# EAGLE design respirho675 (EAGLE 9.6.2)
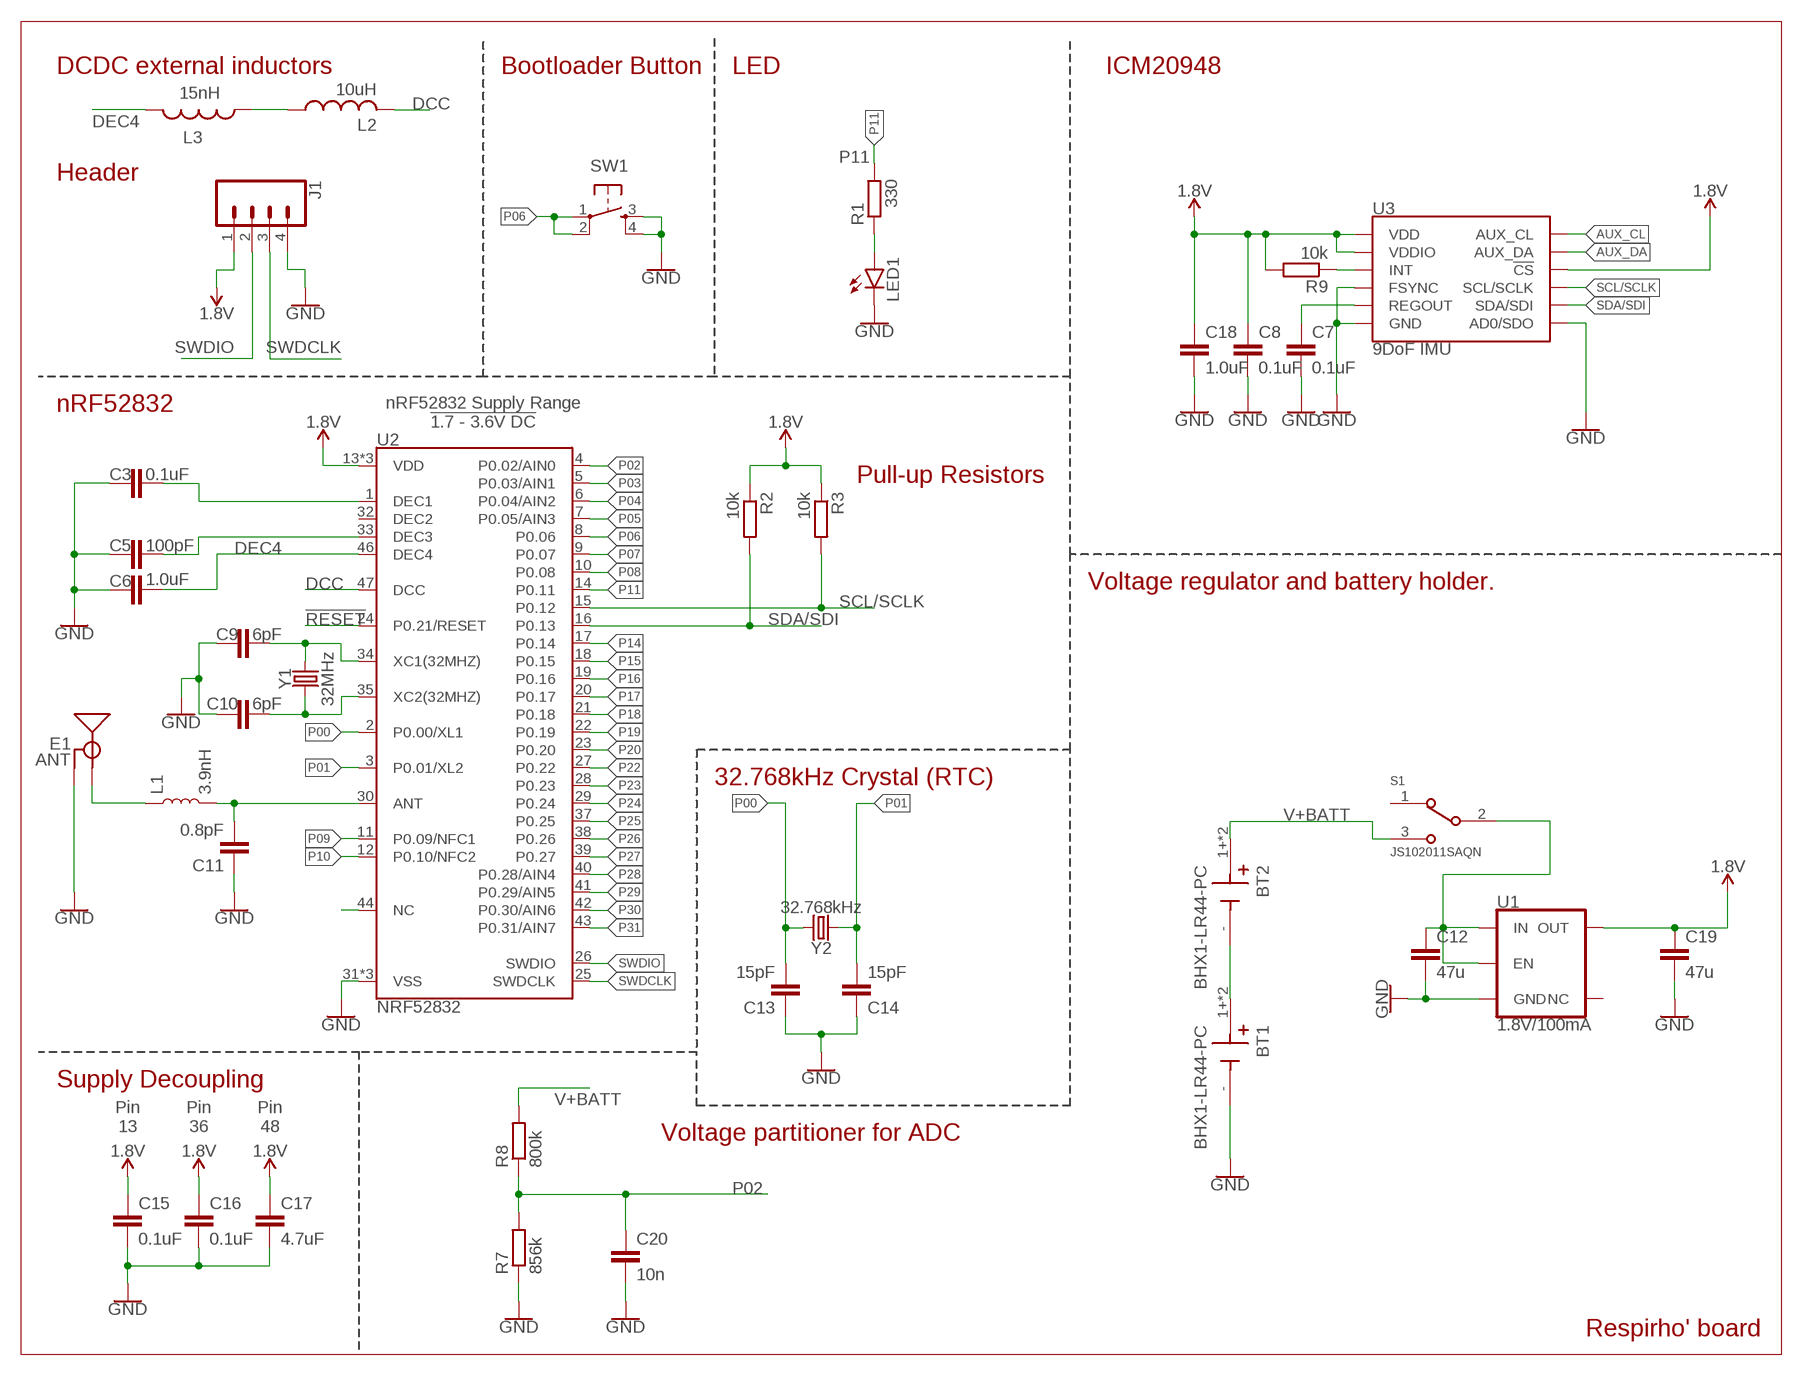
[diagram p0: schematic, sheet 1]

## Parts
BT1  BHX1-LR44-PC  [BAT_BHX1-LR44-PC]
BT2  BHX1-LR44-PC  [BAT_BHX1-LR44-PC]
C3  0.1uF  0.1UF-0402-16V-10%  [0402]
C5  100pF  100PF-0402-50V-5%  [0402]
C6  1.0uF  1.0UF-0402-16V-10%  [0402]
C7  0.1uF  0.1UF-0603-25V-5%  [0603]
C8  0.1uF  0.1UF-0603-25V-5%  [0603]
C9  6pF  6PF-0402-50V-0.5%  [0402]
C10  6pF  6PF-0402-50V-0.5%  [0402]
C11  0.8pF  0.8PF-0402-50V-0.1PF  [0402]
C12  47u  C-EUC0603  [C0603]
C13  15pF  15PF-0402-50V-5%  [0402]
C14  15pF  15PF-0402-50V-5%  [0402]
C15  0.1uF  0.1UF-0402-16V-10%  [0402]
C16  0.1uF  0.1UF-0402-16V-10%  [0402]
C17  4.7uF  4.7UF0603  [0603]
C18  1.0uF  1.0UF-0603-16V-10%-X7R  [0603]
C19  47u  C-EUC0603  [C0603]
C20  10n  C-EUC0603  [C0603]
E1  ANT  ANTENNA-GROUNDEDTRACE-15.2MM  [TRACE_ANTENNA_2.4GHZ_15.2MM]
J1  CONN_04PTH  [1X04]
L1  3.9nH  INDUCTOR-0402-3.9NH  [0402]
L2  10uH  INDUCTOR_0603_L  [RESC0603_L]
L3  15nH  LQG15HS15NJ02D  [INDC1005X55N]
LED1  LEDCHIPLED_1206  [CHIPLED_1206]
R1  330  R-EU_R0805  [R0805]
R2  10k  R-EU_R0603  [R0603]
R3  10k  R-EU_R0603  [R0603]
R7  856k  R-EU_R0603  [R0603]
R8  800k  R-EU_R0603  [R0603]
R9  10k  R-EU_R0603  [R0603]
S1  JS102011SAQN  [SW_JS102011SAQN]
SW1  SWITCH_SPST_4_PINRECT  [TACTILE_SWITCH_SMD_4.6X2.8MM]
U1  1.8V/100mA  V_REG_SP6214-1.8V  [SC70]
U2  NRF52832  [QFN48-6X6MM]
U3  9DoF IMU  ICM-20948  [QFN24-3X3]
Y1  32MHz  CRYSTAL-32MHZ-SMD-2.0X1.6MM  [CRYSTAL-SMD-2.0X1.6MM]
Y2  32.768kHz  CRYSTAL-32.768KHZSMD-3.2X1.5  [CRYSTAL-SMD-3.2X1.5MM]

## Nets
1.8V: C8.1 C15.1 C16.1 C17.1 C18.1 C19.1 J1.1 R2.1 R3.1 R9.2 U1.5(OUT) U2.13(VDD) U2.36(VDD) U2.48(VDD) U3.8(VDDIO) U3.13(VDD) U3.22(!CS)
!RESET!: U2.24(P0.21/RESET)
ANT: C11.2 L1.2 U2.30(ANT)
AUX_CL: U3.7(AUX_CL)
AUX_DA: U3.21(AUX_DA)
DCC: L2.2 U2.47(DCC)
DEC1: C3.2 U2.1(DEC1)
DEC3: C5.2 U2.33(DEC3)
DEC4: C6.2 L3.2 U2.46(DEC4)
GND: BT1.- C3.1 C5.1 C6.1 C7.2 C8.2 C9.1 C10.2 C11.1 C12.2 C13.1 C14.1 C15.2 C16.2 C17.2 C18.2 C19.2 C20.2 E1.GND J1.4 LED1.C R7.1 SW1.3 SW1.4 U1.2(GND) U2.31(VSS) U2.45(VSS) U2.EP(VSS) U3.9(AD0/SDO) U3.11(FSYNC) U3.18(GND) U3.20(GND)
N$1: LED1.A R1.1
N$2: C7.1 U3.10(REGOUT)
N$3: R9.1 U3.12(INT)
N$5: L2.1 L3.1
N$6: BT1.1+(+) BT1.2+(+) BT2.-
N$7: C12.1 S1.2 U1.1(IN) U1.3(EN)
N$11: E1.ANT(SIGNAL) L1.1
NC: U2.44(NC)
P00: C13.2 U2.2(P0.00/XL1) Y2.P$2
P01: C14.2 U2.3(P0.01/XL2) Y2.P$1
P02: C20.1 R7.2 R8.1 U2.4(P0.02/AIN0)
P03: U2.5(P0.03/AIN1)
P04: U2.6(P0.04/AIN2)
P05: U2.7(P0.05/AIN3)
P06: SW1.1 SW1.2 U2.8(P0.06)
P07: U2.9(P0.07)
P08: U2.10(P0.08)
P09: U2.11(P0.09/NFC1)
P10: U2.12(P0.10/NFC2)
P11: R1.2 U2.14(P0.11)
P14: U2.17(P0.14)
P15: U2.18(P0.15)
P16: U2.19(P0.16)
P17: U2.20(P0.17)
P18: U2.21(P0.18)
P19: U2.22(P0.19)
P20: U2.23(P0.20)
P22: U2.27(P0.22)
P23: U2.28(P0.23)
P24: U2.29(P0.24)
P25: U2.37(P0.25)
P26: U2.38(P0.26)
P27: U2.39(P0.27)
P28: U2.40(P0.28/AIN4)
P29: U2.41(P0.29/AIN5)
P30: U2.42(P0.30/AIN6)
P31: U2.43(P0.31/AIN7)
SCL/SCLK: R3.2 U2.15(P0.12) U3.23(SCL/SCLK)
SDA/SDI: R2.2 U2.16(P0.13) U3.24(SDA/SDI)
SWDCLK: J1.3 U2.25(SWDCLK)
SWDIO: J1.2 U2.26(SWDIO)
V+BATT: BT2.1+(+) BT2.2+(+) R8.2 S1.3
XC1: C9.2 U2.34(XC1(32MHZ)) Y1.3
XC2: C10.1 U2.35(XC2(32MHZ)) Y1.1
Unconnected: S1.1 U1.4(NC) U2.32(DEC2)

## Notes on the sheet
- DCDC external inductors | Bootloader Button | LED | ICM20948
- Header
- nRF52832
- nRF52832 Supply Range
  !1.7 - 3.6V DC!
- Pull-up Resistors
- Voltage regulator and battery holder.
- 32.768kHz Crystal (RTC)
- Supply Decoupling
- Pin
  13
- Pin
  36
- Pin
  48
- Voltage partitioner for ADC
- Respirho' board

## Library data of the parts
BT1 BT2 = BHX1-LR44-PC:BHX1-LR44-PC: Battery Retainer Coin, 12.0mm 1 Cell PC Pin; DESCRIPTION: Battery Retainer Coin, 12.0mm 1 Cell PC Pin; DIGI-KEY_PART_NUMBER: BHX1-LR44-PC-G-ND; MF: MPD; MP: BHX1-LR44-PC; PACKAGE: None; PURCHASE-URL: https://pricing.snapeda.com/search/part/BHX1-LR44-PC/?ref=eda
C3 C15 C16 = SparkFun-Capacitors:0.1UF: 0.1µF ceramic capacitors A capacitor is a passive two-terminal electrical component used to store electrical energy temporarily in an electric field.; PROD_ID: CAP-12416
C5 = nrf52832-breakout-temp:100PF: 100pF/0.1nF ceramic capacitors A capacitor is a passive two-terminal electrical component used to store electrical energy temporarily in an electric field.; PROD_ID: CAP-13458
C6 = SparkFun-Capacitors:1.0UF: 1µF ceramic capacitors A capacitor is a passive two-terminal electrical component used to store electrical energy temporarily in an electric field.; PROD_ID: CAP-12417
C7 C8 = SparkFun-Capacitors:0.1UF: 0.1µF ceramic capacitors A capacitor is a passive two-terminal electrical component used to store electrical energy temporarily in an electric field.; PROD_ID: CAP-08604
C9 C10 = nrf52832-breakout-temp:6PF: 15pF ceramic capacitors A capacitor is a passive two-terminal electrical component used to store electrical energy temporarily in an electric field.; PROD_ID: CAP-13455
C11 = nrf52832-breakout-temp:0.8PF: 0.8pF ceramic capacitors A capacitor is a passive two-terminal electrical component used to store electrical energy temporarily in an electric field.; PROD_ID: CAP-13456
C12 C19 C20 = rcl:C-EU: CAPACITOR, European symbol; SPICEPREFIX: C
C13 C14 = SparkFun-Capacitors:15PF: 15pF ceramic capacitors A capacitor is a passive two-terminal electrical component used to store electrical energy temporarily in an electric field.; PROD_ID: CAP-13063
C17 = SparkFun-Capacitors:4.7UF: 4.7µF ceramic capacitors A capacitor is a passive two-terminal electrical component used to store electrical energy temporarily in an electric field.; PROD_ID: CAP-08280
C18 = SparkFun-Capacitors:1.0UF: 1µF ceramic capacitors A capacitor is a passive two-terminal electrical component used to store electrical energy temporarily in an electric field.; PROD_ID: CAP-13930
E1 = SparkFun-RF:ANTENNA-GROUNDED: Antenna w/ Ground Connection 2.4GHz antennae with signal and ground terminals. TRACE_ANTENNA_2.4GHZ_15.2MM - Meander Trace antenna 15.2 x 5.7mm footprint Based on layout from TI app note AN043 <http://www.ti.com/lit/an/swra117d/swra117d.pdf>. TRACE_ANTENNA_2.4GHZ_25.7MM - Inverted F trace antenna 25.7 x 7.5 mm footprint. Based on layout from TI design note DN0007 <http://www.ti.com/lit/an/swru120b/swru120b.pdf>.
J1 = SparkFun-Connectors:CONN_04: Multi connection point. Often used as Generic Header-pin footprint for 0.1 inch spaced/style header connections On any of the 0.1 inch spaced packages, you can populate with these: Break Away Headers - Straight <https://www.sparkfun.com/products/116> (PRT-00116) Break Away Male Headers - Right Angle <https://www.sparkfun.com/products/553> (PRT-00553) Female Headers <https://www.sparkfun.com/products/115> (PRT-00115) Break Away Headers - Machine Pin <https://www.sparkfun.com/products/117> (PRT-00117) Break Away Female Headers - Swiss Machine Pin <https://www.sparkfun.com/products/743> (PRT-00743) For SCREWTERMINALS and SPRING TERMINALS visit here: Screw Terimnals on SparkFun.com <https://www.sparkfun.com/search/results?term=Screw+Terminals> (5mm/3.5mm/2.54mm spacing) This device is also useful as a general connection point to wire up your design to another part of your project. Our various solder wires solder well into these plated through hole pads. Hook-Up Wire - Assortment (Stranded, 22 AWG) <https://www.sparkfun.com/products/11375> (PRT-11375) Hook-Up Wire - Assortment (Solid Core, 22 AWG) <https://www.sparkfun.com/products/11367> (PRT-11367) View the entire wire category on our website here <https://www.sparkfun.com/categories/141> Special notes: Molex polarized connector foot print use with SKU : PRT-08231 with associated crimp pins and housings. 1MM SMD Version SKU: PRT-10208; PROD_ID: CONN-09696
L1 = nrf52832-breakout-temp:INDUCTOR: Inductors Resist changes in electrical current. Basically a coil of wire. SparkFun Products: SparkFun Load Cell Amplifier - HX711 <https://www.sparkfun.com/products/13879> IOIO-OTG - V2.2 <https://www.sparkfun.com/products/13613>; PROD_ID: NDUC-13457
L2 = Nordic_nRF:INDUCTOR: Generic chip inductor
L3 = LQG15HS15NJ02D:LQG15HS15NJ02D: Ind RF Chip Multi-Layer 15nH 5% 100MHz 8Q-Factor Air 300mA 0402 Paper T/R; DESCRIPTION: Inductor with Inductance: 15nH Tol. +/-5%, Package: 0402 _1005_; DIGI-KEY_PART_NUMBER: 490-2625-1-ND; DIGI-KEY_PURCHASE_URL: https://www.digikey.com/product-detail/en/murata-electronics/LQG15HS15NJ02D/490-2625-1-ND/662905?utm_source=snapeda&utm_medium=aggregator&utm_campaign=symbol; MF: Murata Electronics; MP: LQG15HS15NJ02D; PACKAGE: 1005 Murata
LED1 = led:LED: LED OSRAM: - CHIPLED LG R971, LG N971, LY N971, LG Q971, LY Q971, LO R971, LY R971 LH N974, LH R974 LS Q976, LO Q976, LY Q976 LO Q996 - Hyper CHIPLED LW Q18S LB Q993, LB Q99A, LB R99A - SideLED LS A670, LO A670, LY A670, LG A670, LP A670 LB A673, LV A673, LT A673, LW A673 LH A674 LY A675 LS A676, LA A676, LO A676, LY A676, LW A676 LS A679, LY A679, LG A679 - Hyper Micro SIDELED® LS Y876, LA Y876, LO Y876, LY Y876 LT Y87S - SmartLED LW L88C, LW L88S LB L89C, LB L89S, LG L890 LS L89K, LO L89K, LY L89K LS L896, LA L896, LO L896, LY L896 - TOPLED LS T670, LO T670, LY T670, LG T670, LP T670 LSG T670, LSP T670, LSY T670, LOP T670, LYG T670 LG T671, LOG T671, LSG T671 LB T673, LV T673, LT T673, LW T673 LH T674 LS T676, LA T676, LO T676, LY T676, LB T676, LH T676, LSB T676, LW T676 LB T67C, LV T67C, LT T67C, LS T67K, LO T67K, LY T67K, LW E67C LS E67B, LA E67B, LO E67B, LY E67B, LB E67C, LV E67C, LT E67C LW T67C LS T679, LY T679, LG T679 LS T770, LO T770, LY T770, LG T770, LP T770 LB T773, LV T773, LT T773, LW T773 LH T774 LS E675, LA E675, LY E675, LS T675 LS T776, LA T776, LO T776, LY T776, LB T776 LHGB T686 LT T68C, LB T68C - Hyper Mini TOPLED® LB M676 - Mini TOPLED Santana® LG M470 LS M47K, LO M47K, LY M47K Source: http://www.osram.convergy.de LUXEON: - LUMILED® LXK2-PW12-R00, LXK2-PW12-S00, LXK2-PW14-U00, LXK2-PW14-V00 LXK2-PM12-R00, LXK2-PM12-S00, LXK2-PM14-U00 LXK2-PE12-Q00, LXK2-PE12-R00, LXK2-PE12-S00, LXK2-PE14-T00, LXK2-PE14-U00 LXK2-PB12-K00, LXK2-PB12-L00, LXK2-PB12-M00, LXK2-PB14-N00, LXK2-PB14-P00, LXK2-PB14-Q00 LXK2-PR12-L00, LXK2-PR12-M00, LXK2-PR14-Q00, LXK2-PR14-R00 LXK2-PD12-Q00, LXK2-PD12-R00, LXK2-PD12-S00 LXK2-PH12-R00, LXK2-PH12-S00 LXK2-PL12-P00, LXK2-PL12-Q00, LXK2-PL12-R00 Source: www.luxeon.com KINGBRIGHT: KA-3528ASYC Source: www.kingbright.com
R1-R3 R7-R9 = rcl:R-EU_: RESISTOR, European symbol; SPICEPREFIX: R
S1 = JS102011SAQN:JS102011SAQN: JS10 Series SPDT On-On 6 V 0.3 A Gull Wing SMT Slide Switch http://www.snapeda.com/parts/JS102011SAQN/C%26K%20Components/view-part/; DESCRIPTION: Slide Switch SPDT Surface Mount, Right Angle; DIGI-KEY_PART_NUMBER: 401-1999-1-ND; MF: C&K; MP: JS102011SAQN; PACKAGE: None; PURCHASE-URL: https://pricing.snapeda.com/search/part/JS102011SAQN/?ref=eda
SW1 = SparkFun-Electromechanical:SWITCH_SPST_4_PIN; PROD_ID: SWCH-13065
U1 = SparkFun-IC-Power:V_REG_SP6214: Voltage Regulator - SP6214 SP6214 Series SC-70-5 Micropower SC-70 100 mA CMOS LDO Regulator Datasheet <https://www.exar.com/content/document.ashx?id=654> SparkFun Products: MP3 Trigger <https://www.sparkfun.com/products/13720> SparkFun Particle Sensor Breakout <https://www.sparkfun.com/products/14045>; PROD_ID: VREG-08428
U2 = nrf52832-breakout-temp:NRF52832: Nordic nRF52832 Bluetooth Smart/ANT/2.4GHz RF SoC The nRF52832 SoC is a powerful, highly flexible ultra-low power multiprotocol SoC ideally suited for Bluetooth® Smart ANT and 2.4GHz ultra low-power wireless applications. The nRF52832 SoC is built around a 32-bit ARM® Cortex™-M4F CPU with 512kB + 64kB RAM. The embedded 2.4GHz transceiver supports Bluetooth Smart, ANT and proprietary 2.4 GHz protocol stack. It is on air compatible with the nRF51 Series, nRF24L and nRF24AP Series products from Nordic Semiconductor. Product Page <https://www.nordicsemi.com/eng/Products/Bluetooth-low-energy2/nRF52832>; PROD_ID: IC-13460
U3 = SparkFun-Sensors:ICM-20948: ICM-20948 9 Degree of Freedom IMU World’s lowest power 9-axis MotionTracking device that is ideally suited for smartphones, tablets, wearable sensors, and IoT applications. Includes onboard Digital Motion Processor to offload computations from the host processor Datasheet <https://cdn.sparkfun.com/assets/learn_tutorials/5/5/0/MPU9250REV1.0.pdf> SparkFun Products: SparkFun IMU Breakout - ICM-20948 <https://www.sparkfun.com/products/15182>; PROD_ID: IC-14247
Y1 = nrf52832-breakout-temp:CRYSTAL-32MHZ: 32MHz Crystal Digikey Example <http://www.digikey.com/product-detail/en/murata-electronics-north-america/XRCGB32M000F2P00R0/490-9769-1-ND/4952013> Frequency: 32MHz Frequency Stability: ±20ppm Frequency Tolerance: ±20ppm Load Capacitance: 6pF; PROD_ID: XTAL-13459
Y2 = SparkFun-Clocks:CRYSTAL-32.768KHZ: 32.768kHz Crystal Frequency: 32.768kHz Frequency Stability: ±20ppm Load Capacitance: 12.5pF (PTH-2X6 & SMD-3.2X1.5), 6pF (SMD-2X6); PROD_ID: XTAL-13062

## Board
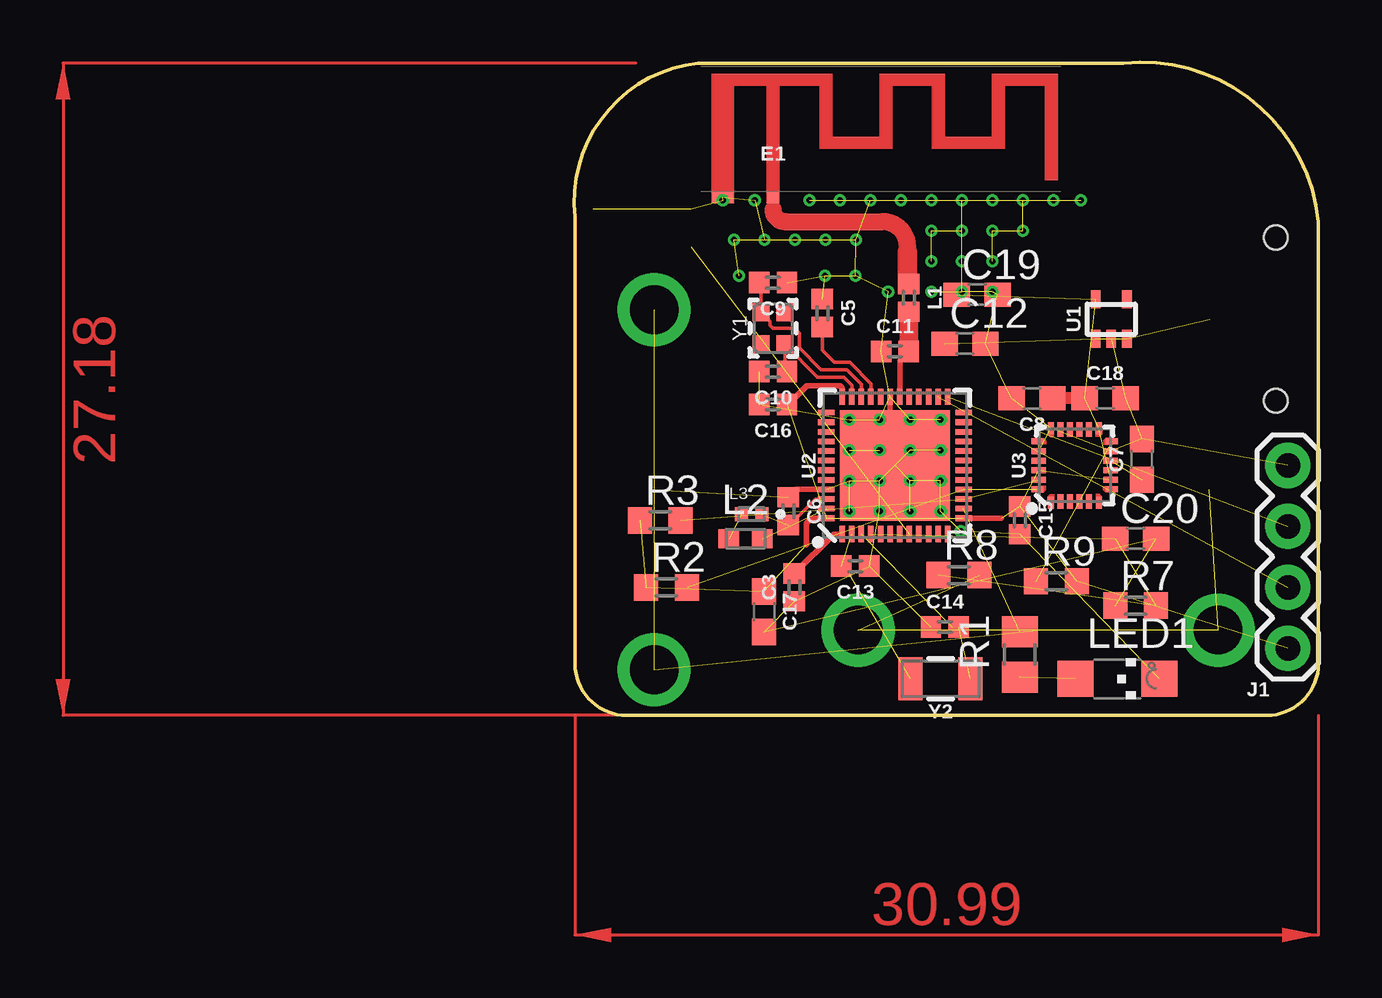
[diagram p1: board, top side]
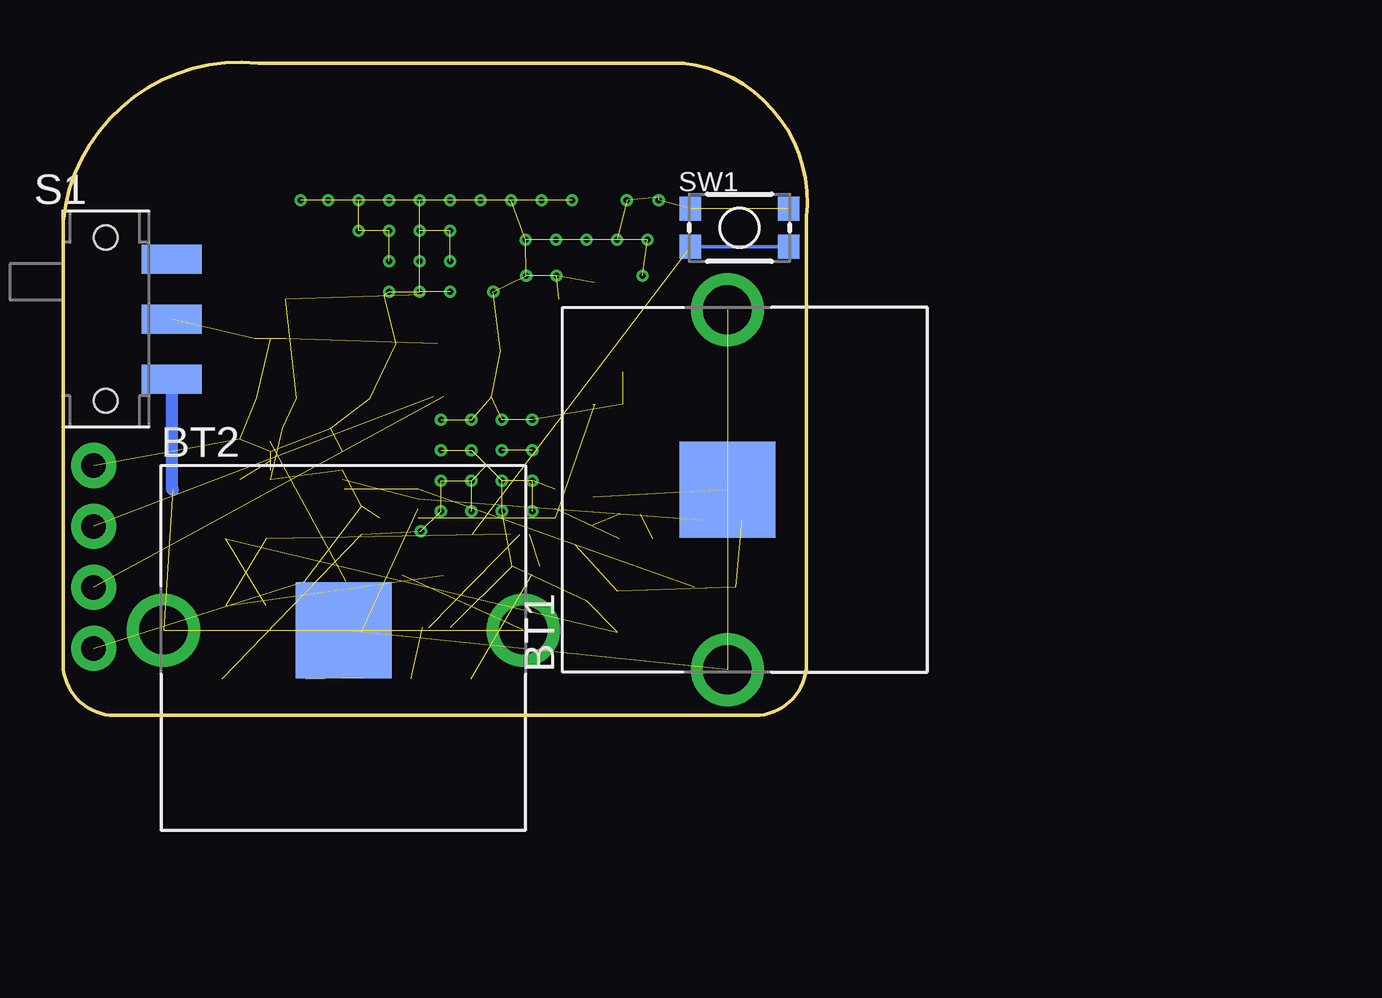
[diagram p2: board, bottom side, seen from below]

Size 31.02 x 27.22 mm. Coordinates in mm from the lower left corner, seen from the top.
Outline: 22.89,27.18 5.17,27.18 arc90 0.03,20.77 0.03,2.15 arc90 2.18,0 28.87,0 arc90 31.02,2.15 31.02,20.57 arc90 22.89,27.18
Copper layers (1*16): Top 0.035mm / dielectric 1.5mm / Bottom 0.035mm
Design rules "SparkFun-2-layer-FAB-LIMIT *": minimum track width 4mil, minimum drill 6mil, track to track 6mil, track to pad 6mil, pad to pad 6mil, via to via 6mil, smd to smd 6mil, copper to edge 4mil, drill to drill 4mil, minimum pad ring 5mil, minimum via ring 5mil, stop-mask expansion 4mil, vias tented up to drill 25mil, thermal gap 10mil
tRestrict: 2 lines

### Footprints (pad centres in the part's own frame; a part is rotated, then mirrored left to right if it is on the bottom)
BAT_BHX1-LR44-PC = drill 2.03: 1+ -7.5,0; 2+ 7.5,0 | smd 4 x 4: - 0,0
0402 = smd 0.85 x 0.9: 1 -0.58,0; 2 0.58,0
0603 = smd 1.1 x 1: 1 -0.85,0; 2 0.85,0
C0603 = smd 1.1 x 1: 1 -0.85,0; 2 0.85,0
TRACE_ANTENNA_2.4GHZ_15.2MM = smd 0.5 x 0.5: ANT 0,-0.25 | smd 0.9 x 0.5: GND -2.1,-0.25
1X04 = drill 1.016 pad 1.88: 1 0,0; 2 2.54,0; 3 5.08,0; 4 7.62,0
RESC0603_L = smd 0.85 x 0.8: 1 -0.7,0; 2 0.7,0
INDC1005X55N = smd 0.54 x 0.6: 1 -0.432,0; 2 0.432,0
CHIPLED_1206 = smd 1.5 x 1.5: A 0,-1.75; C 0,1.75
R0805 = smd 1.3 x 1.5: 1 -0.95,0; 2 0.95,0
R0603 = smd 1 x 1.1: 1 -0.85,0; 2 0.85,0
SW_JS102011SAQN = smd 1.2 x 2.5: 1 -2.5,2.75; 2 0,2.75; 3 2.5,2.75 | hole 1: -3.4,0; 3.4,0
TACTILE_SWITCH_SMD_4.6X2.8MM = smd 0.9 x 1: 1 -2.05,-0.8; 2 2.05,-0.8; 3 2.05,0.8; 4 -2.05,0.8
SC70 = smd 0.4 x 0.75: 1 -0.65,-0.825; 2 0,-0.825; 3 0.65,-0.825; 4 0.65,0.825; 5 -0.65,0.825
QFN48-6X6MM = smd 0.68 x 0.23: 1 -2.86,2.2; 2 -2.86,1.8; 3 -2.86,1.4; 4 -2.86,1; 5 -2.86,0.6; 6 -2.86,0.2; 7 -2.86,-0.2; 8 -2.86,-0.6; 9 -2.86,-1; 10 -2.86,-1.4; 11 -2.86,-1.8; 12 -2.86,-2.2; 25 2.86,-2.2; 26 2.86,-1.8; 27 2.86,-1.4; 28 2.86,-1; 29 2.86,-0.6; 30 2.86,-0.2; 31 2.86,0.2; 32 2.86,0.6; 33 2.86,1; 34 2.86,1.4; 35 2.86,1.8; 36 2.86,2.2 | smd 0.23 x 0.68: 13 -2.2,-2.86; 14 -1.8,-2.86; 15 -1.4,-2.86; 16 -1,-2.86; 17 -0.6,-2.86; 18 -0.2,-2.86; 19 0.2,-2.86; 20 0.6,-2.86; 21 1,-2.86; 22 1.4,-2.86; 23 1.8,-2.86; 24 2.2,-2.86; 37 2.2,2.86; 38 1.8,2.86; 39 1.4,2.86; 40 1,2.86; 41 0.6,2.86; 42 0.2,2.86; 43 -0.2,2.86; 44 -0.6,2.86; 45 -1,2.86; 46 -1.4,2.86; 47 -1.8,2.86; 48 -2.2,2.86 | smd 4.6 x 4.6: EP 0,0
QFN24-3X3 = smd 0.495 x 0.25: 1 -1.552,1; 6 -1.552,-1; 13 1.552,-1; 18 1.552,1 | smd 0.6 x 0.25: 2 -1.5,0.6; 3 -1.5,0.2; 4 -1.5,-0.2; 5 -1.5,-0.6; 14 1.5,-0.6; 15 1.5,-0.2; 16 1.5,0.2; 17 1.5,0.6 | smd 0.25 x 0.495: 7 -1,-1.552; 12 1,-1.552; 19 1,1.552; 24 -1,1.552 | smd 0.25 x 0.6: 8 -0.6,-1.5; 9 -0.2,-1.5; 10 0.2,-1.5; 11 0.6,-1.5; 20 0.6,1.5; 21 0.2,1.5; 22 -0.2,1.5; 23 -0.6,1.5
CRYSTAL-SMD-2.0X1.6MM = smd 0.75 x 0.7: 1 -0.675,-0.5; 2 0.675,-0.5; 3 0.675,0.5; 4 -0.675,0.5
CRYSTAL-SMD-3.2X1.5MM = smd 1 x 1.8: P$1 -1.25,0; P$2 1.25,0

### Placement (x,y rotation side)
BT1  3.34,9.4 90 bottom
BT2  19.34,3.56 0 bottom
C3  9.18,5.33 90 top
C5  10.35,16.76 270 top
C6  8.92,8.51 270 top
C7  23.66,10.67 90 top
C8  19.08,13.21 180 top
C9  8.29,18.03 180 top
C10  8.29,14.33 180 top
C11  13.37,15.16 0 top
C12  16.29,15.49 0 top
C13  11.72,6.22 180 top
C14  15.45,3.68 0 top
C15  18.58,8.13 270 top
C16  8.29,12.95 180 top
C17  7.91,4.32 270 top
C18  22.13,13.21 0 top
C19  16.8,17.53 0 top
C20  23.4,7.37 0 top
E1  8.29,21.84 0 top
J1  29.75,2.79 90 top
L1  13.95,17.4 270 top
L2  7.15,7.37 0 top
L3  7.4,8.38 0 top
LED1  22.64,1.52 270 top
R1  18.58,2.54 90 top
R2  3.84,5.33 0 top
R3  3.59,8.13 0 top
R7  23.4,4.57 0 top
R8  16.04,5.84 0 top
R9  20.1,5.59 0 top
S1  29.24,16.51 270 bottom
SW1  2.83,20.32 0 bottom
U1  22.39,16.51 0 top
U2  13.37,10.41 90 top
U3  20.86,10.41 90 top
Y1  8.29,16.13 90 top
Y2  15.27,1.52 180 top

### Tracks (layer width: path | path; a pad name or v marks a point on that pad's centre or on a via)
1.8V  (15 unrouted)
  Top 0.229: U2.36 11.17,13.65 11.08,13.74 9.71,13.74 8.92,12.95 | U2.13 17.8,8.21 | U2.48 9.9,8.21 9.69,8 9.69,7.11
  Top 0.508: C8.1 20.1,13.37 20.27,13.21 C18.1
ANT
  Top 0.229: U2.30 13.57,14.78 C11.2
  Top 0.762: C11.2 L1.2
DCC  (1 unrouted)
DEC1
  Top 0.229: U2.1 10.82,7.55 C3.2
DEC3
  Top 0.152: U2.33 12.37,13.83 11.49,14.71 10.85,14.71 10.35,15.21 C5.2
DEC4  (1 unrouted)
  Top 0.152: C6.2 8.98,7.93 10.06,9.01 U2.46
GND  (via drill 0.25)  (76 unrouted)
  Top 0.152: 13.17,10.61 v12.73,11.05
  Top 0.229: U2.31 13.17,10.61 U2.EP | C16.2 7.65,12.95 | U2.45 9.25,9.41 C6.1
  other vias: 6.19,21.46 6.87,18.31 10.45,18.31 11.72,18.31 13.09,17.65 14.89,17.65 16.11,7.67 14,9.78 14,8.51 14,11.05 14,12.32 12.73,12.32 12.73,9.78 12.73,8.51 11.46,8.51 11.46,9.78 11.46,11.05 11.46,12.32 15.27,12.32 15.27,11.05 15.27,9.78 15.27,8.51 14.89,18.92 14.89,20.19 14.89,21.46 13.62,21.46 12.35,21.46 11.08,21.46 9.81,21.46 11.74,19.81 10.47,19.81 9.2,19.81 7.53,21.46 16.16,17.65 16.16,18.92 16.16,20.19 16.16,21.46 17.43,21.46 18.7,21.46 19.97,21.46 21.12,21.46 7.93,19.81 6.66,19.81 17.43,17.65 17.43,18.92 17.43,20.19 18.7,20.19
N$1  (1 unrouted)
N$2  (1 unrouted)
N$3  (1 unrouted)
N$5  (1 unrouted)
N$6  (2 unrouted)
N$7  (3 unrouted)
N$11
  Top 0.508: E1.ANT 8.29,21.08
  Top 0.711: 8.29,21.08 arc90 8.8,20.57 12.86,20.57 arc-90 13.89,19.54 13.89,19.3
  Top 0.813: L1.1 13.89,18.04 13.89,19.3
P00  (2 unrouted)
  Top 0.152: C13.2 11.48,5.88
P01  (2 unrouted)
  Top 0.152: C14.2 15.76,3.68
P02  (3 unrouted)
P06  (1 unrouted)
  Bottom 0.152: SW1.1 SW1.2
P11  (1 unrouted)
P29
  Top 0.152: U2.41
P31
  Top 0.152: U2.43
SCL/SCLK  (2 unrouted)
SDA/SDI  (2 unrouted)
SWDCLK  (1 unrouted)
SWDIO  (1 unrouted)
V+BATT  (3 unrouted)
  Bottom 0.508: S1.3 26.49,9.44 26.45,9.4
XC1
  Top 0.152: U2.34 11.97,13.79 11.36,14.4 10.3,14.4 9.38,15.32 9.38,15.93 9.18,16.13 8.29,16.13 8.16,16.26 8.16,16.43 Y1.3 7.79,17.95 C9.2
XC2
  Top 0.152: U2.35 11.57,13.76 11.23,14.1 10.15,14.1 Y1.1 8.79,14.33 C10.1
(copper drawn outside any net)
  shapes: Top area x2

### Text on the board
Measures: Units in inches